# EasyEDA schematic schematic.json
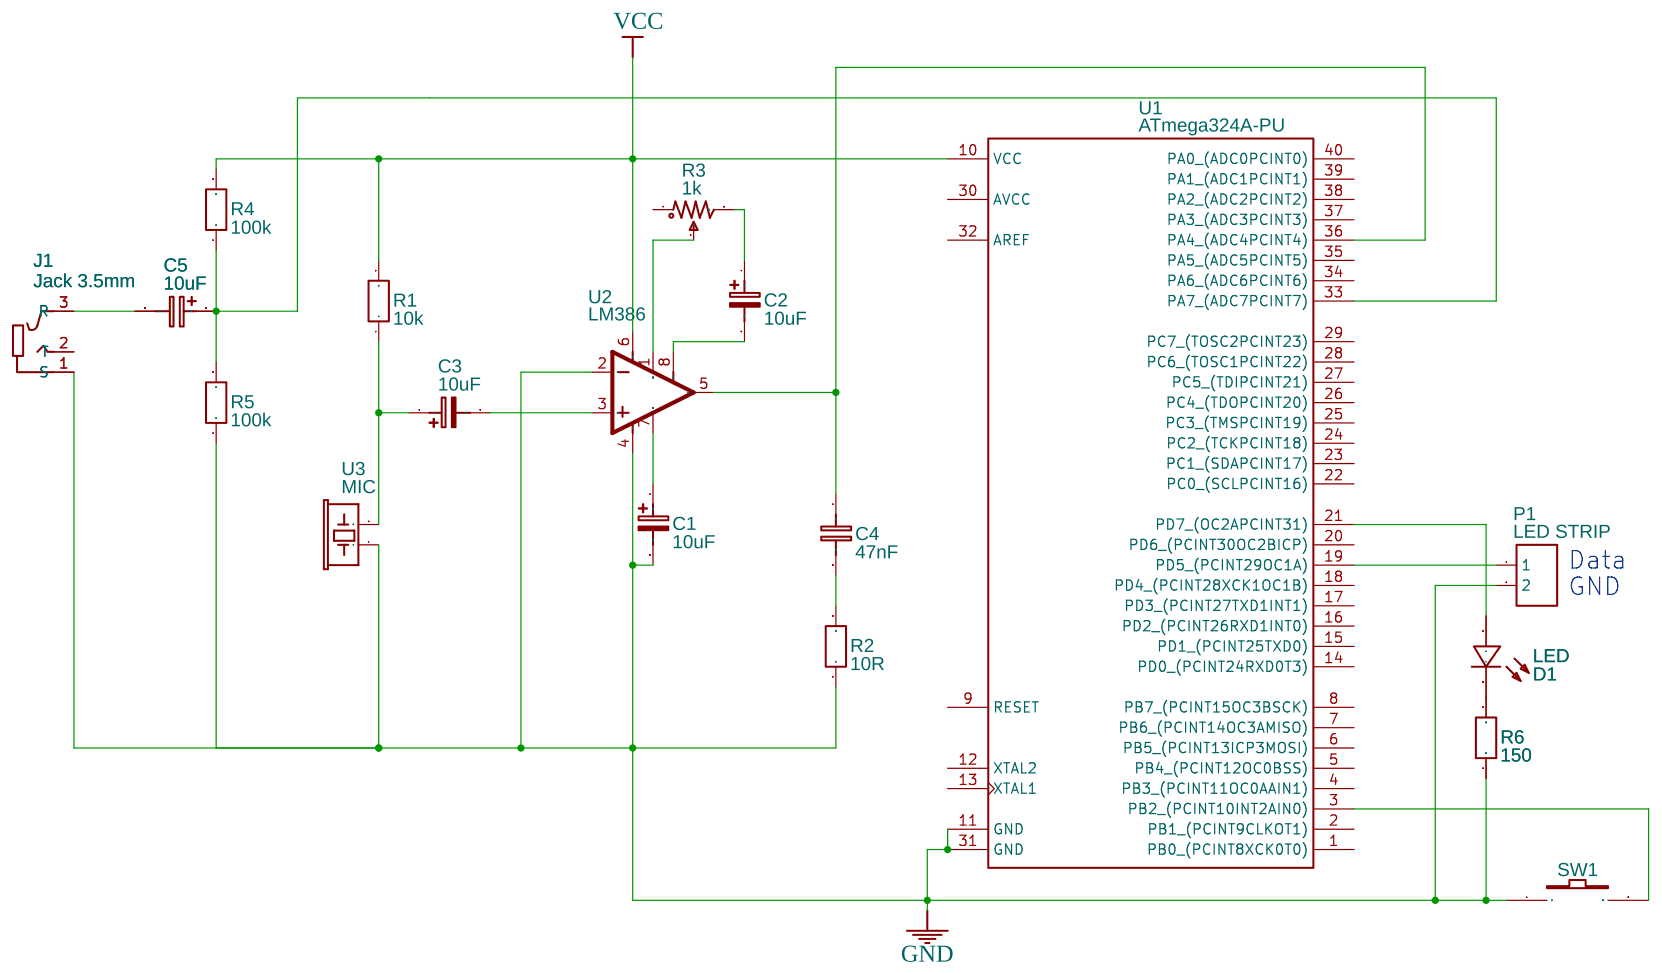
[diagram p0: schematic sheet]

## Parts
C1  10uF  [CAP-D3.0XF1.5]
C2  10uF  [CAP-D3.0XF1.5]
C3  10uF  [CAP-D3.0XF1.5]
C4  47nF  [RAD-0.1]
C5  10uF  [CAP-D3.0XF1.5]
J1  Jack 3.5mm
LED  D1  [LED-3MM/2.54]
P1  LED STRIP  [HDR-1X2/2.54]
R1  10k  [AXIAL-0.3]
R2  10R  [AXIAL-0.3]
R3  1k  [RES-ADJ_3386P]
R4  100k  [AXIAL-0.3]
R5  100k  [AXIAL-0.3]
R6  150  [AXIAL-0.3]
SW1  EVQ22705R  [KEY-6.0*6.0-4]
U1  ATmega324A-PU  [DIP40]
U2  LM386  [DIP08]
U3  MIC  [MIC_ELECTRET_SMD]

## Library data of the parts
C1-C3 C5 = Cap_Electrolytic(TH)_D3.0XF1.5_EU: Contributor: EasyEDA; Manufacturer Part: ?
C4 = Cap_RAD-0.1_EU: Manufacturer Part: ?
J1 = -: Manufacturer Part: ?
LED = -: Supplier: LCSC; Manufacturer: EVERLIGHT; Manufacturer Part: 204-10SURD/S530-A3; Supplier Part: C99772
P1 = -: Supplier: LCSC; Manufacturer: BOOMELE; Manufacturer Part: 2.54-1*2PFemale; image: //image.lceda.cn/szlcsc/C49661.jpg; Supplier Part: C49661
R1 R2 R4-R6 = Res_AXIAL-0.3(1/8W)_EU: Manufacturer Part: ?
R3 = 3386P-1-101LF_US: Supplier: LCSC; Manufacturer: Bochen; Manufacturer Part: 3386P-1-101LF; Contributor: EasyEDA; Supplier Part: C125022
SW1 = -: Supplier: LCSC; Manufacturer: PANASONIC; Contributor: LCSC; Supplier Part: C79156
U1 = -: 8-bit AVR Microcontroller, 32KB Flash, 1KB EEPROM, 2KB SRAM, 40-pin PDIP, Industrial Grade (-40u7648 to 85u7648); Manufacturer Part: ?
U2 U3 = -: Contributor: SparkFun; Manufacturer Part: ?

## Nets
GND: C1.2 J1.1(S) P1.2 R2.1 R5.1 R6.1 SW1.1 U1.11(GND) U1.31(GND) U2.2(-IN) U2.4(V-) U3.1
VCC: R1.2 R4.2 U1.10(VCC) U2.6(V+)
Net-(C1-1): C1.1 U2.7(BP)
Net-(C2-1): C2.1 R3.3
Net-(C2-2): C2.2 U2.8(GAIN)
Net-(C3-1): C3.1 R1.1 U3.2
Net-(C3-2): C3.2 U2.3(+IN)
Net-(C4-1): C4.1 U1.36(PA4 (ADC4PCINT4)) U2.5(OUT)
Net-(C4-2): C4.2 R2.2
Net-(C5-1): C5.1 R4.1 R5.2 U1.33(PA7 (ADC7PCINT7))
Net-(C5-2): C5.2 J1.3(R)
Net-(LED-1): LED.1(+) U1.21(PD7 (OC2APCINT31))
Net-(LED-2): LED.2(-) R6.2
Net-(P1-1): P1.1 U1.19(PD5 (PCINT29OC1A))
Net-(R3-2): R3.2 U2.1(GAIN)
Net-(SW1-2): SW1.2 U1.3(PB2 (PCINT10INT2AIN0))

Not connected (* = marked no-connect by the designer): J1 2(T); R3 1; U1 1(PB0 (PCINT8XCK0T0)) 2(PB1 (PCINT9CLKOT1)) 4(PB3 (PCINT11OC0AAIN1)) 5(PB4 (PCINT12OC0BSS)) 6(PB5 (PCINT13ICP3MOSI)) 7(PB6 (PCINT14OC3AMISO)) 8(PB7 (PCINT15OC3BSCK)) 9(RESET) 12(XTAL2) 13(XTAL1) 14(PD0 (PCINT24RXD0T3)) 15(PD1 (PCINT25TXD0)) 16(PD2 (PCINT26RXD1INT0)) 17(PD3 (PCINT27TXD1INT1)) 18(PD4 (PCINT28XCK1OC1B)) 20(PD6 (PCINT30OC2BICP)) 22(PC0 (SCLPCINT16)) 23(PC1 (SDAPCINT17)) 24(PC2 (TCKPCINT18)) 25(PC3 (TMSPCINT19)) 26(PC4 (TDOPCINT20)) 27(PC5 (TDIPCINT21)) 28(PC6 (TOSC1PCINT22)) 29(PC7 (TOSC2PCINT23)) 30(AVCC) 32(AREF) 34(PA6 (ADC6PCINT6)) 35(PA5 (ADC5PCINT5)) 37(PA3 (ADC3PCINT3)) 38(PA2 (ADC2PCINT2)) 39(PA1 (ADC1PCINT1)) 40(PA0 (ADC0PCINT0))

## Notes on the sheet
- Data
- GND
